# Altium schematic sheet LOGIC_FPGA.SchDoc: FPGA Logic
size B; Engineer: M. Jones; Organization: Michael Jones; DocumentNumber: 4; Revision: RA.1; SheetNumber: 4; SheetTotal: 7
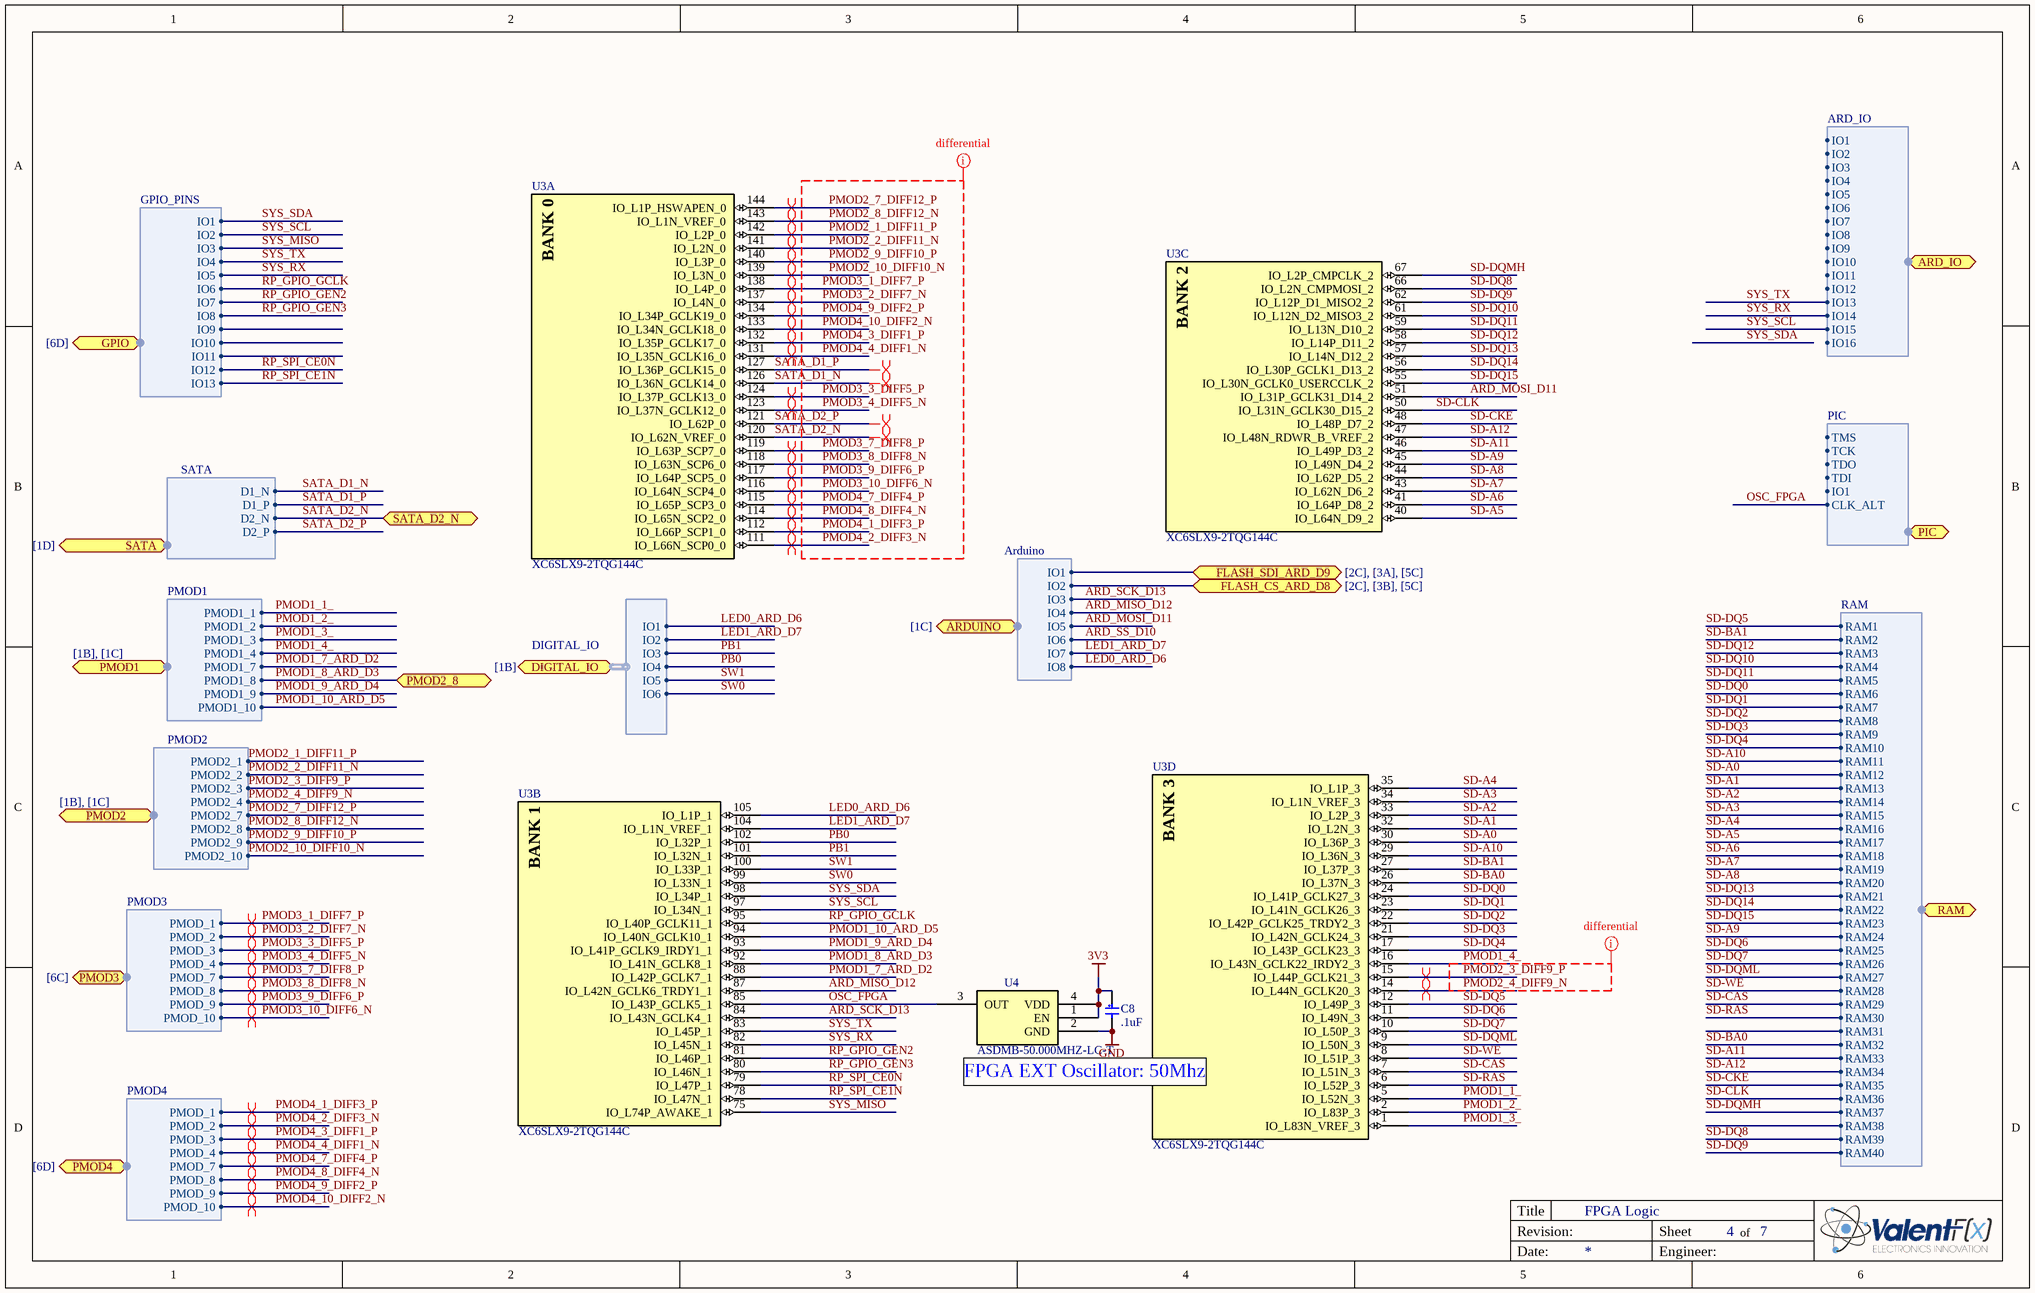
[diagram p0: LOGIC_FPGA.SchDoc]

## Parts
C8  .1uF  [c0603]
U3  XC6SLX9-2TQG144C  [TQ144_L]  (parts A,B,C,D of 7)
U4  ASDMB-50.000MHZ-LC-T  [ASDMB - osc]

## Ports
ARD_IO (harness ARD_IO, see [6B]), ARDUINO (harness Arduino, see [1C]), DIGITAL_IO (harness DIGITAL_IO, see [1B]), FLASH_CS_ARD_D8 (see [2C], [3B], [5C]), FLASH_SDI_ARD_D9 (see [2C], [3A], [5C]), GPIO (harness GPIO_PINS, see [6D]), PIC (harness PIC, see [1C]), PMOD1 (harness PMOD1, see [1B], [1C]), PMOD2 (harness PMOD2, see [1B], [1C]), PMOD2_8, PMOD3 (harness PMOD3, see [6C]), PMOD4 (harness PMOD4, see [6D]), RAM (harness RAM, see [1C]), SATA (harness SATA, see [1D]), SATA_D2_N

## Harnesses
SATA: D1_P, D1_N, D2_N, D2_P
RAM: RAM1, RAM2, RAM3, RAM4, RAM5, RAM6, RAM7, RAM8, RAM9, RAM10, RAM11, RAM12, RAM13, RAM14, RAM15, RAM16, RAM17, RAM18, RAM19, RAM20, RAM21, RAM22, RAM23, RAM24, RAM25, RAM26, RAM27, RAM28, RAM29, RAM30, RAM31, RAM32, RAM33, RAM34, RAM35, RAM36, RAM37, RAM38, RAM39, RAM40
GPIO_PINS: IO3, IO4, IO5, IO6, IO7, IO8, IO9, IO10, IO11, IO12, IO13, IO1, IO2
PMOD3: PMOD_7, PMOD_8, PMOD_9, PMOD_10, PMOD_1, PMOD_2, PMOD_3, PMOD_4
PMOD4: PMOD_7, PMOD_8, PMOD_9, PMOD_10, PMOD_1, PMOD_2, PMOD_3, PMOD_4
ARD_IO: IO3, IO4, IO5, IO6, IO7, IO8, IO9, IO10, IO11, IO12, IO13, IO1, IO2, IO14, IO15, IO16
PIC: TMS, TCK, TDO, TDI, CLK_ALT, IO1
DIGITAL_IO: IO1, IO2, IO3, IO4, IO5, IO6
Arduino: IO1, IO2, IO3, IO4, IO5, IO6, IO7, IO8
PMOD1: PMOD1_1, PMOD1_2, PMOD1_3, PMOD1_4, PMOD1_7, PMOD1_8, PMOD1_9, PMOD1_10
PMOD2: PMOD2_1, PMOD2_2, PMOD2_3, PMOD2_4, PMOD2_7, PMOD2_8, PMOD2_9, PMOD2_10

## Nets
3V3: C8.1 U4.1(EN) U4.4(VDD)
GND: C8.2 U4.2(GND)
ARD_MISO_D12: U3.87(IO_L42N_GCLK6_TRDY1_1) ; port ARDUINO.IO4
ARD_MOSI_D11: U3.51(IO_L31P_GCLK31_D14_2) ; port ARDUINO.IO5
ARD_SCK_D13: U3.84(IO_L43N_GCLK4_1) ; port ARDUINO.IO3
ARD_SS_D10: port ARDUINO.IO6
FLASH_CS_ARD_D8: port FLASH_CS_ARD_D8, port ARDUINO.IO2
FLASH_SDI_ARD_D9: port FLASH_SDI_ARD_D9, port ARDUINO.IO1
LED0_ARD_D6: U3.105(IO_L1P_1) ; port DIGITAL_IO.IO1, port ARDUINO.IO8
LED1_ARD_D7: U3.104(IO_L1N_VREF_1) ; port DIGITAL_IO.IO2, port ARDUINO.IO7
OSC_FPGA: U3.85(IO_L43P_GCLK5_1) U4.3(OUT) ; port PIC.CLK_ALT
PB0: U3.102(IO_L32P_1) ; port DIGITAL_IO.IO4
PB1: U3.101(IO_L32N_1) ; port DIGITAL_IO.IO3
PMOD1_1_: U3.5(IO_L52N_3) ; port PMOD1.PMOD1_1
PMOD1_2_: U3.2(IO_L83P_3) ; port PMOD1.PMOD1_2
PMOD1_3_: U3.1(IO_L83N_VREF_3) ; port PMOD1.PMOD1_3
PMOD1_4_: U3.16(IO_L43N_GCLK22_IRDY2_3) ; port PMOD1.PMOD1_4
PMOD1_7_ARD_D2: U3.88(IO_L42P_GCLK7_1) ; port PMOD1.PMOD1_7
PMOD1_8_ARD_D3: U3.92(IO_L41N_GCLK8_1) ; port PMOD2_8, port PMOD1.PMOD1_8
PMOD1_9_ARD_D4: U3.93(IO_L41P_GCLK9_IRDY1_1) ; port PMOD1.PMOD1_9
PMOD1_10_ARD_D5: U3.94(IO_L40N_GCLK10_1) ; port PMOD1.PMOD1_10
PMOD2_1_DIFF11_P: U3.142(IO_L2P_0) ; port PMOD2.PMOD2_1
PMOD2_2_DIFF11_N: U3.141(IO_L2N_0) ; port PMOD2.PMOD2_2
PMOD2_3_DIFF9_P: U3.15(IO_L44P_GCLK21_3) ; port PMOD2.PMOD2_3
PMOD2_4_DIFF9_N: U3.14(IO_L44N_GCLK20_3) ; port PMOD2.PMOD2_4
PMOD2_7_DIFF12_P: U3.144(IO_L1P_HSWAPEN_0) ; port PMOD2.PMOD2_7
PMOD2_8_DIFF12_N: U3.143(IO_L1N_VREF_0) ; port PMOD2.PMOD2_8
PMOD2_9_DIFF10_P: U3.140(IO_L3P_0) ; port PMOD2.PMOD2_9
PMOD2_10_DIFF10_N: U3.139(IO_L3N_0) ; port PMOD2.PMOD2_10
PMOD3_1_DIFF7_P: U3.138(IO_L4P_0) ; port PMOD3.PMOD_1
PMOD3_2_DIFF7_N: U3.137(IO_L4N_0) ; port PMOD3.PMOD_2
PMOD3_3_DIFF5_P: U3.124(IO_L37P_GCLK13_0) ; port PMOD3.PMOD_3
PMOD3_4_DIFF5_N: U3.123(IO_L37N_GCLK12_0) ; port PMOD3.PMOD_4
PMOD3_7_DIFF8_P: U3.119(IO_L63P_SCP7_0) ; port PMOD3.PMOD_7
PMOD3_8_DIFF8_N: U3.118(IO_L63N_SCP6_0) ; port PMOD3.PMOD_8
PMOD3_9_DIFF6_P: U3.117(IO_L64P_SCP5_0) ; port PMOD3.PMOD_9
PMOD3_10_DIFF6_N: U3.116(IO_L64N_SCP4_0) ; port PMOD3.PMOD_10
PMOD4_1_DIFF3_P: U3.112(IO_L66P_SCP1_0) ; port PMOD4.PMOD_1
PMOD4_2_DIFF3_N: U3.111(IO_L66N_SCP0_0) ; port PMOD4.PMOD_2
PMOD4_3_DIFF1_P: U3.132(IO_L35P_GCLK17_0) ; port PMOD4.PMOD_3
PMOD4_4_DIFF1_N: U3.131(IO_L35N_GCLK16_0) ; port PMOD4.PMOD_4
PMOD4_7_DIFF4_P: U3.115(IO_L65P_SCP3_0) ; port PMOD4.PMOD_7
PMOD4_8_DIFF4_N: U3.114(IO_L65N_SCP2_0) ; port PMOD4.PMOD_8
PMOD4_9_DIFF2_P: U3.134(IO_L34P_GCLK19_0) ; port PMOD4.PMOD_9
PMOD4_10_DIFF2_N: U3.133(IO_L34N_GCLK18_0) ; port PMOD4.PMOD_10
RP_GPIO_GCLK: U3.95(IO_L40P_GCLK11_1) ; port GPIO.IO6
RP_GPIO_GEN2: U3.81(IO_L46P_1) ; port GPIO.IO7
RP_GPIO_GEN3: U3.80(IO_L46N_1) ; port GPIO.IO8
RP_SPI_CE0N: U3.79(IO_L47P_1) ; port GPIO.IO12
RP_SPI_CE1N: U3.78(IO_L47N_1) ; port GPIO.IO13
SATA_D1_N: U3.126(IO_L36N_GCLK14_0) ; port SATA.D1_N
SATA_D1_P: U3.127(IO_L36P_GCLK15_0) ; port SATA.D1_P
SATA_D2_N: U3.120(IO_L62N_VREF_0) ; port SATA_D2_N, port SATA.D2_N
SATA_D2_P: U3.121(IO_L62P_0) ; port SATA.D2_P
SD-A0: U3.30(IO_L36P_3) ; port RAM.RAM12
SD-A1: U3.32(IO_L2N_3) ; port RAM.RAM13
SD-A2: U3.33(IO_L2P_3) ; port RAM.RAM14
SD-A3: U3.34(IO_L1N_VREF_3) ; port RAM.RAM15
SD-A4: U3.35(IO_L1P_3) ; port RAM.RAM16
SD-A5: U3.40(IO_L64N_D9_2) ; port RAM.RAM17
SD-A6: U3.41(IO_L64P_D8_2) ; port RAM.RAM18
SD-A7: U3.43(IO_L62N_D6_2) ; port RAM.RAM19
SD-A8: U3.44(IO_L62P_D5_2) ; port RAM.RAM20
SD-A9: U3.45(IO_L49N_D4_2) ; port RAM.RAM24
SD-A10: U3.29(IO_L36N_3) ; port RAM.RAM11
SD-A11: U3.46(IO_L49P_D3_2) ; port RAM.RAM33
SD-A12: U3.47(IO_L48N_RDWR_B_VREF_2) ; port RAM.RAM34
SD-BA0: U3.26(IO_L37N_3) ; port RAM.RAM32
SD-BA1: U3.27(IO_L37P_3) ; port RAM.RAM2
SD-CAS: U3.7(IO_L51N_3) ; port RAM.RAM29
SD-CKE: U3.48(IO_L48P_D7_2) ; port RAM.RAM35
SD-CLK: U3.50(IO_L31N_GCLK30_D15_2) ; port RAM.RAM36
SD-DQ0: U3.24(IO_L41P_GCLK27_3) ; port RAM.RAM6
SD-DQ1: U3.23(IO_L41N_GCLK26_3) ; port RAM.RAM7
SD-DQ2: U3.22(IO_L42P_GCLK25_TRDY2_3) ; port RAM.RAM8
SD-DQ3: U3.21(IO_L42N_GCLK24_3) ; port RAM.RAM9
SD-DQ4: U3.17(IO_L43P_GCLK23_3) ; port RAM.RAM10
SD-DQ5: U3.12(IO_L49P_3) ; port RAM.RAM1
SD-DQ6: U3.11(IO_L49N_3) ; port RAM.RAM25
SD-DQ7: U3.10(IO_L50P_3) ; port RAM.RAM26
SD-DQ8: U3.66(IO_L2N_CMPMOSI_2) ; port RAM.RAM39
SD-DQ9: U3.62(IO_L12P_D1_MISO2_2) ; port RAM.RAM40
SD-DQ10: U3.61(IO_L12N_D2_MISO3_2) ; port RAM.RAM4
SD-DQ11: U3.59(IO_L13N_D10_2) ; port RAM.RAM5
SD-DQ12: U3.58(IO_L14P_D11_2) ; port RAM.RAM3
SD-DQ13: U3.57(IO_L14N_D12_2) ; port RAM.RAM21
SD-DQ14: U3.56(IO_L30P_GCLK1_D13_2) ; port RAM.RAM22
SD-DQ15: U3.55(IO_L30N_GCLK0_USERCCLK_2) ; port RAM.RAM23
SD-DQMH: U3.67(IO_L2P_CMPCLK_2) ; port RAM.RAM37
SD-DQML: U3.9(IO_L50N_3) ; port RAM.RAM27
SD-RAS: U3.6(IO_L52P_3) ; port RAM.RAM30
SD-WE: U3.8(IO_L51P_3) ; port RAM.RAM28
SW0: U3.99(IO_L33N_1) ; port DIGITAL_IO.IO6
SW1: U3.100(IO_L33P_1) ; port DIGITAL_IO.IO5
SYS_MISO: U3.75(IO_L74P_AWAKE_1) ; port GPIO.IO3
SYS_RX: U3.82(IO_L45N_1) ; port GPIO.IO5, port ARD_IO.IO14
SYS_SCL: U3.97(IO_L34N_1) ; port GPIO.IO2, port ARD_IO.IO15
SYS_SDA: U3.98(IO_L34P_1) ; port GPIO.IO1
SYS_TX: U3.83(IO_L45P_1) ; port GPIO.IO4, port ARD_IO.IO13

## Layout directives
net class differential: PMOD1_4_, PMOD2_1_DIFF11_P, PMOD2_2_DIFF11_N, PMOD2_3_DIFF9_P, PMOD2_4_DIFF9_N, PMOD2_7_DIFF12_P, PMOD2_8_DIFF12_N, PMOD2_9_DIFF10_P, PMOD2_10_DIFF10_N, PMOD3_1_DIFF7_P, PMOD3_2_DIFF7_N, PMOD3_3_DIFF5_P, PMOD3_4_DIFF5_N, PMOD3_7_DIFF8_P, PMOD3_8_DIFF8_N, PMOD3_9_DIFF6_P, PMOD3_10_DIFF6_N, PMOD4_1_DIFF3_P, PMOD4_2_DIFF3_N, PMOD4_3_DIFF1_P, PMOD4_4_DIFF1_N, PMOD4_7_DIFF4_P, PMOD4_8_DIFF4_N, PMOD4_9_DIFF2_P, PMOD4_10_DIFF2_N
differential pair: PMOD2_1_DIFF11_P, PMOD2_2_DIFF11_N, PMOD2_3_DIFF9_P, PMOD2_4_DIFF9_N, PMOD2_7_DIFF12_P, PMOD2_8_DIFF12_N, PMOD2_9_DIFF10_P, PMOD2_10_DIFF10_N, PMOD3_1_DIFF7_P, PMOD3_2_DIFF7_N, PMOD3_3_DIFF5_P, PMOD3_4_DIFF5_N, PMOD3_7_DIFF8_P, PMOD3_8_DIFF8_N, PMOD3_9_DIFF6_P, PMOD3_10_DIFF6_N, PMOD4_1_DIFF3_P, PMOD4_2_DIFF3_N, PMOD4_3_DIFF1_P, PMOD4_4_DIFF1_N, PMOD4_7_DIFF4_P, PMOD4_8_DIFF4_N, PMOD4_9_DIFF2_P, PMOD4_10_DIFF2_N, SATA_D1_N, SATA_D1_P, SATA_D2_N, SATA_D2_P

## Notes on the sheet
- FPGA EXT Oscillator: 50Mhz
- Title
- Revision:
- Sheet
- of
- Date:
- Engineer:
- (in symbol FPGA - XC6SLX9-2TQG144C, part A) BANK 0
- (in symbol FPGA - XC6SLX9-2TQG144C, part B) BANK 1
- (in symbol FPGA - XC6SLX9-2TQG144C, part C) BANK 2
- (in symbol FPGA - XC6SLX9-2TQG144C, part D) BANK 3

## Library data of the parts
C8 = C0603 - CL10F104ZA8NNNC: CAP CER 0.1UF 25V Y5V 0603; Manufacturer: Samsung Electro-Mechanics America, Inc; Capacitance: 0.1µF; Tolerance: -20%, +80%; Temperature Coefficient: Y5V (F); Accept Alternative: Yes; Manufacturer Part Number: CL10F104ZA8NNNC; Value: .1uF; Supplier 1: Digi-Key; Supplier Part Number 1: 1276-1011-1-ND; RoHS: RoHS Compliant; Category: Capacitors; Stock 1: 400907; Pricing 1: 1=0.1, 10=0.017, 25=0.012, 50=0.009, 100=0.0076, 250=0.00624, 500=0.00536, 1000=0.00417 (USD); Package / Case: 0603 (1608 Metric); Packaging: Cut Tape (CT); ComponentLink1URL: http://www.samsungsem.com/servlet/FileDownload?type=spec&file=CL10F104ZA8NNNC.pdf; ComponentLink1Description: http://www.samsungsem.com/servlet/FileDownload?type=spec&file=CL10F104ZA8NNNC.pdf; Voltage - Rated: 25V; Mounting Type: Surface Mount, MLCC; Operating Temperature: -30°C ~ 85°C; Applications: General Purpose; Ratings: -; Size / Dimension: 0.063" L x 0.031" W (1.60mm x 0.80mm); Height - Seated (Max): -; Thickness (Max): 0.035" (0.90mm); Lead Spacing: -; Features: -; Lead Style: -
U3 = FPGA - XC6SLX9-2TQG144C: IC FPAG SPARTAN 6 9K 144TQFP; Manufacturer: Xilinx Inc; Number of Logic Elements/Cells: 9152; Number of LABs/CLBs: 715; Total RAM Bits: 589824; Number of I /O: 102; Voltage - Supply: 1.14 V ~ 1.26 V; Supplier 1: America II Electronics; Supplier Part Number 1: 122-1745-ND; Manufacturer Part Number: XC6SLX9-2TQG144C; RoHS: RoHS Compliant; Category: Integrated Circuits (ICs); Stock 1: 994; Pricing 1: 1=12.80,1=11.05,1000=9.59 (USD); Number of Gates: -; Mounting Type: Surface Mount; Operating Temperature: 0°C ~ 85°C; Package / Case: 144-LQFP; Supplier Device Package: 144-TQFP (20x20); ComponentLink1URL: http://www.xilinx.com/support/documentation/data_sheets/ds160.pdf; ComponentLink1Description: http://www.xilinx.com/support/documentation/data_sheets/ds160.pdf; Value: XC6SLX9-2TQG144C; Supplier 2: Digi-Key
U4 = ASDMB-50.000MHZ-LC-T: OSC MEMS 50.000 MHZ SMD; Manufacturer: Abracon Corporation; Frequency: 50MHz; Function: Tri-State (Output Enable); Output: CMOS; Voltage - Supply: 1.8 V ~ 3.3 V; Frequency Stability: ±50ppm; Current - Supply (Max): 16mA; Current - Supply (Disable) (Max): 15µA; Supplier 1: Digi-Key; Manufacturer Part Number: ASDMB-50.000MHZ-LC-T; RoHS: RoHS Compliant; Category: Crystals and Oscillators; Stock 1: 967; Pricing 1: 1=1.69, 10=1.463, 50=1.2826, 100=1.0125, 500=0.855 (USD); Type: MEMS (Silicon); Operating Temperature: -40°C ~ 85°C; Mounting Type: Surface Mount; Size / Dimension: 0.098" L x 0.079" W (2.50mm x 2.00mm); Height: 0.035" (0.90mm); Package / Case: 4-SMD, No Lead (DFN, LCC); Packaging: Cut Tape (CT); ComponentLink1URL: http://www.abracon.com/Oscillators/ASDMB.pdf; ComponentLink1Description: http://www.abracon.com/Oscillators/ASDMB.pdf; Supplier Part Number 1: 535-11738-1-ND; Value: ASDMB-50.000MHZ-LC-T